# EAGLE design bpf-0805-4pc-breakout (EAGLE 5.11)
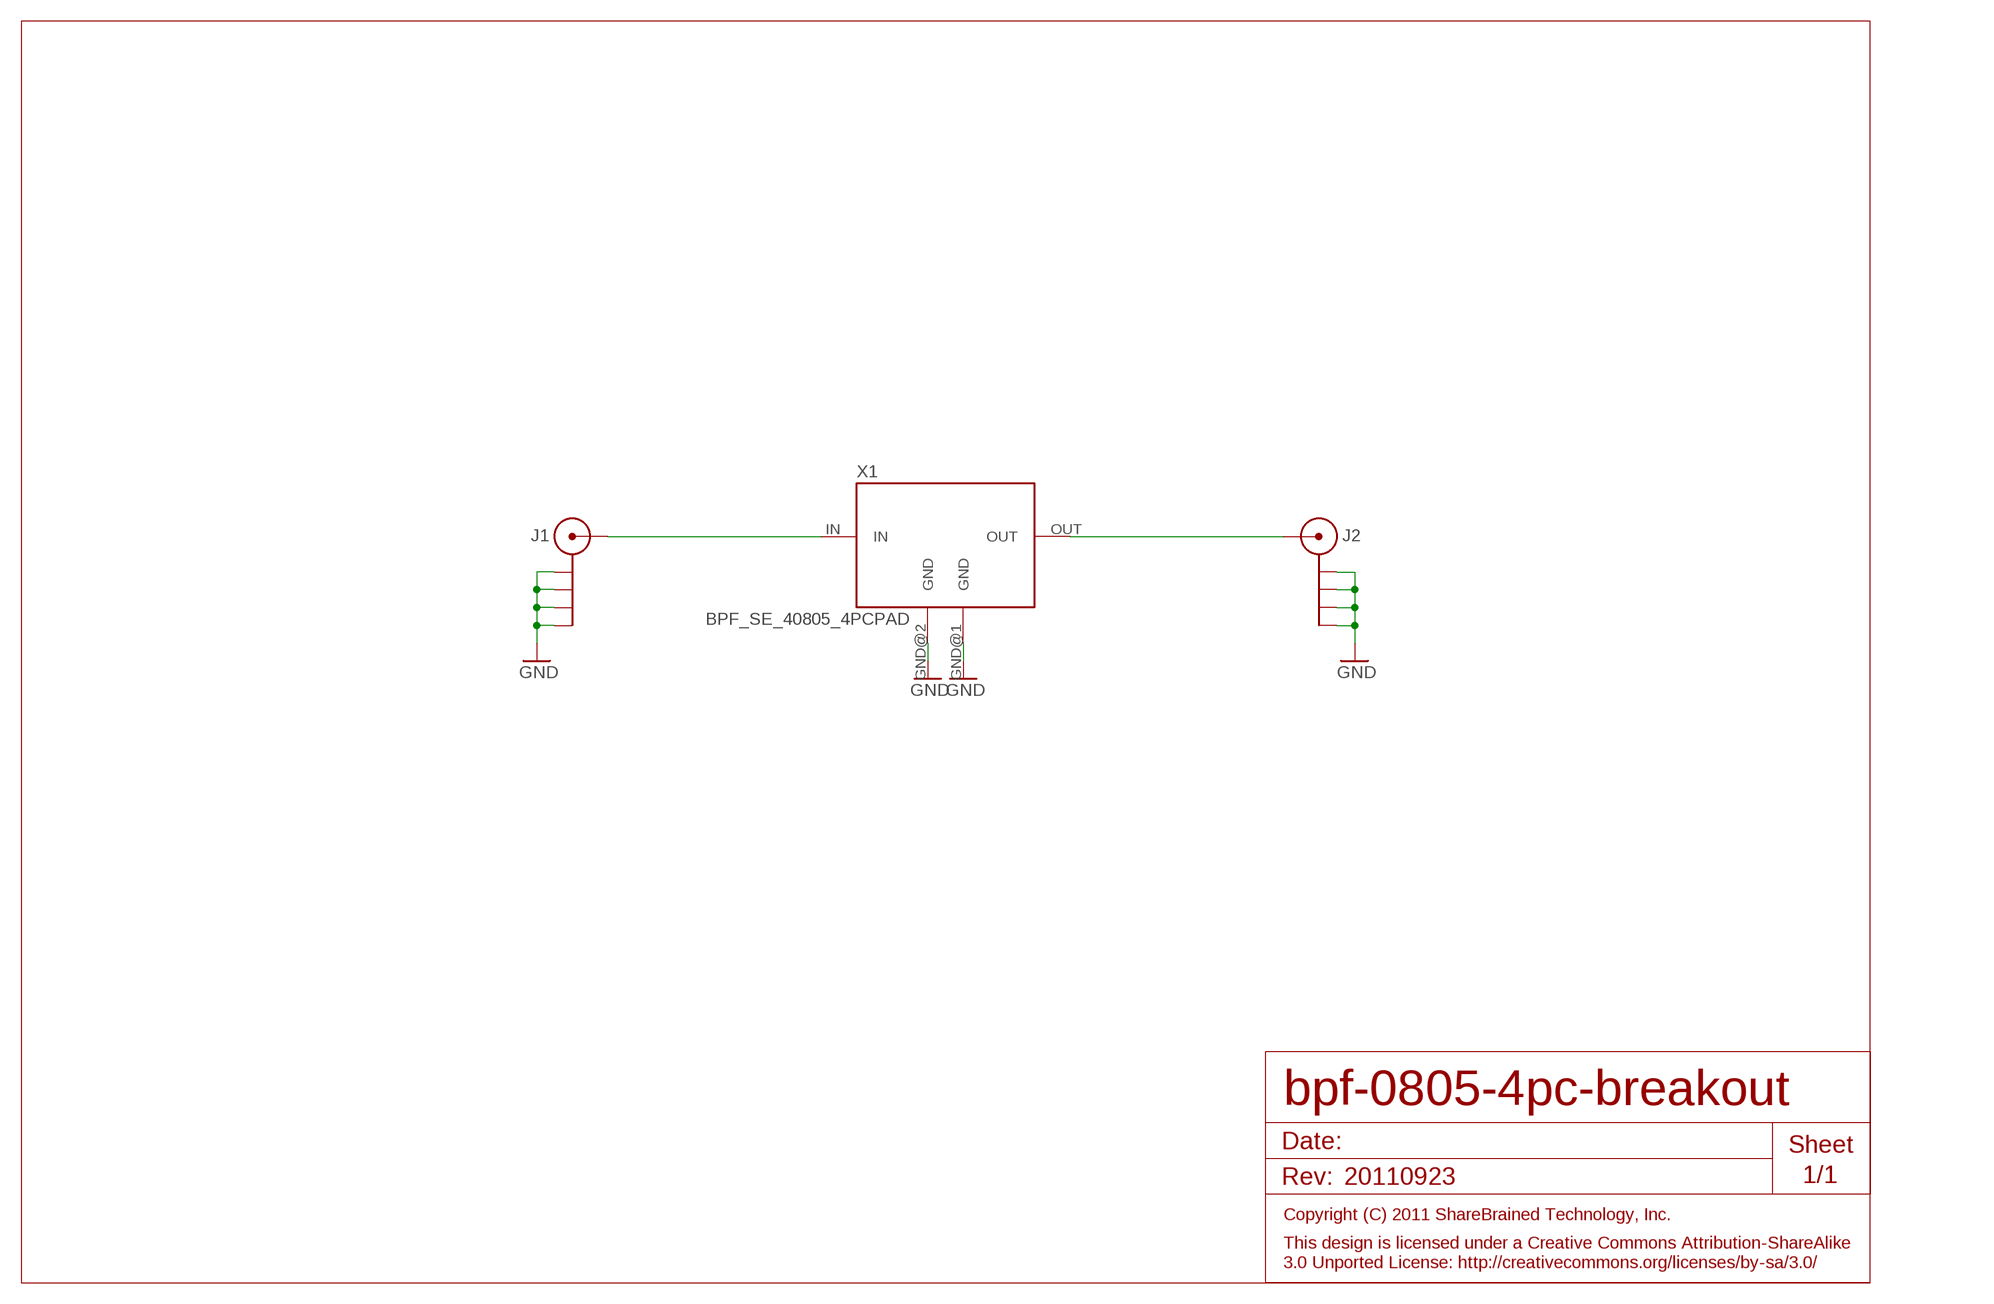
[diagram p0: schematic, sheet 1]

## Parts
J1  SMA142-0701-801  [142-0701-801]
J2  SMA142-0701-801  [142-0701-801]
X1  BPF_SE_40805_4PCPAD  [0805_4PCPAD]

## Nets
GND: J1.RING@1(RING) J1.RING@2(RING) J1.RING@3(RING) J1.RING@4(RING) J2.RING@1(RING) J2.RING@2(RING) J2.RING@3(RING) J2.RING@4(RING) X1.GND@1(GND) X1.GND@2(GND)
N$3: J1.TIP X1.IN
N$4: J2.TIP X1.OUT

## Notes on the sheet
- 20110923

## Library data of the parts
J1 J2 = sma:SMA
X1 = filter:BPF_SE_4

## Board
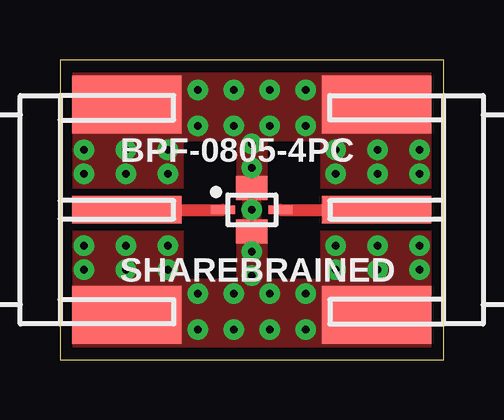
[diagram p1: board, top side]
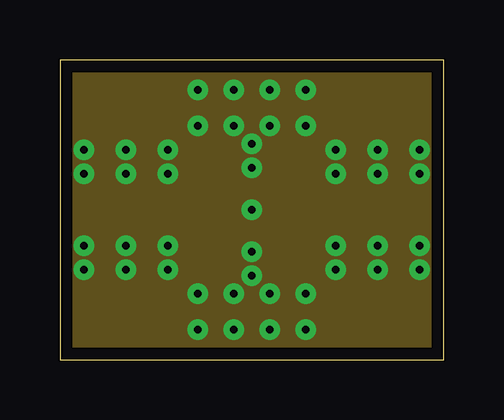
[diagram p2: board, inner layer Route2]
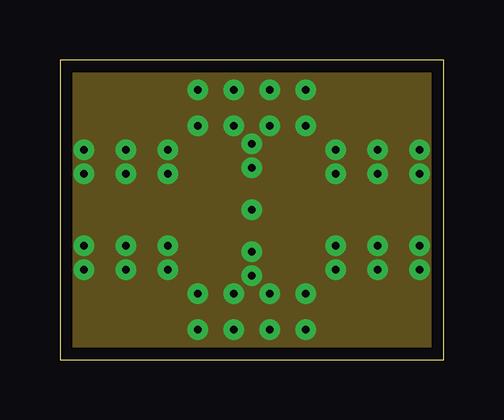
[diagram p3: board, inner layer Route15]
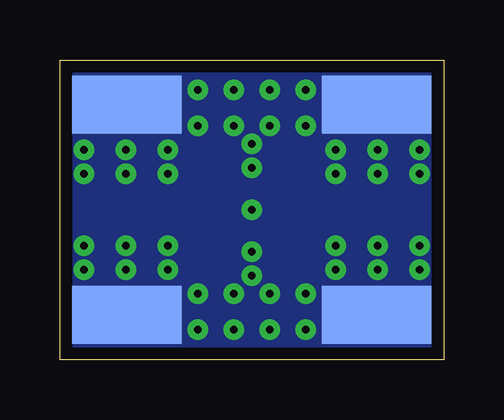
[diagram p4: board, bottom side, seen from below]

Size 16 x 12.5 mm. Coordinates in mm from the lower left corner, seen from the top.
Outline: 0,0 16,0 16,12.5 0,12.5 0,0
Copper layers (1+2*15+16): Top 0.0178mm / dielectric 0.3048mm / Route2 0.0356mm / dielectric 0.7112mm / Route15 0.0356mm / dielectric 0.3048mm / Bottom 0.0178mm
Design rules "bpf-0805-4pc-breakout": minimum track width 0.3mm, minimum drill 13mil, track to track 0.2mm, track to pad 0.2mm, pad to pad 0.2mm, via to via 0.2mm, smd to smd 0.2mm, copper to edge 20mil, drill to drill 16mil, minimum pad ring 10mil, minimum via ring 10mil, stop-mask expansion 3mil, vias tented up to drill 13mil, thermal gap 8mil

### Footprints (pad centres in the part's own frame; a part is rotated, then mirrored left to right if it is on the bottom)
142-0701-801 = smd 2.413 x 4.572: RING@1 -4.381,-2.794; RING@2 4.381,-2.794 | smd 2.413 x 4.572 bottom: RING@3 -4.381,-2.794; RING@4 4.381,-2.794 | smd 1.143 x 4.572: TIP 0,-2.794
0805_4PCPAD = smd 1.3 x 1: GND@1 0,-0.9; GND@2 0,0.9 | smd 1 x 0.35: IN -1.2,0; OUT 1.2,0

### Placement (x,y rotation side)
J1  0,6.25 90 top
J2  16,6.25 270 top
X1  8,6.25 0 top

### Tracks (layer width: path | path; a pad name or v marks a point on that pad's centre or on a via)
GND  (via drill 0.33)
  other vias: 5.75,11.25 2.75,8.75 10.25,9.75 5.75,9.75 8.75,11.25 10.25,11.25 2.75,3.75 10.25,1.25 7.25,1.25 5.75,1.25 8.75,1.25 5.75,2.75 8,8 8,4.5 8,6.25 8,9 8,3.5 4.5,3.75 4.5,4.75 2.75,4.75 2.75,7.75 4.5,7.75 4.5,8.75 11.5,3.75 8.75,2.75 13.25,4.75 11.5,4.75 13.25,7.75 13.25,8.75 11.5,8.75 11.5,7.75 13.25,3.75 7.25,2.75 7.25,11.25 7.25,9.75 1,8.75 1,7.75 1,4.75 1,3.75 15,4.75 15,3.75 15,7.75 15,8.75 8.75,9.75 10.25,2.75
  pour Route2 (no thermals): 0,0 0,15 21.5,15 21.5,0
  pour Route15 (no thermals): 0,0 0,15 21.5,15 21.5,0
  pour Top (isolate 0.3, no thermals): 0,7 0,12.5 16,12.5 16,7 11,7 11,9.25 8.5,9.25 8.5,6.25 7.5,6.25 7.5,9.25 5,9.25 5,7
  pour Top (isolate 0.3, no thermals): 0,0 0,5.5 5,5.5 5,3.25 7.5,3.25 7.5,6.25 8.5,6.25 8.5,3.25 11,3.25 11,5.5 16,5.5 16,0
  pour Bottom (no thermals): 0,0 0,15 21.5,15 21.5,0
N$3
  Top 0.5: J1.TIP X1.IN
N$4
  Top 0.5: X1.OUT J2.TIP

### Text on the board
tPlace: BPF-0805-4PC | SHAREBRAINED